# EAGLE schematic Un_SecUSB_2 (EAGLE 7.1.0)
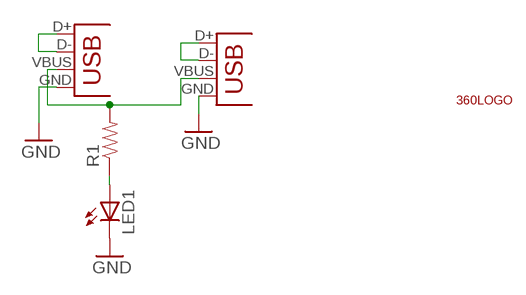
[diagram p0: schematic, sheet 1]

## Parts
LED1  LED0603  [LED-0603]
R1  RESISTOR0603-RES  [0603-RES]
U$1  360LOGO_0.8  [360LOGO_0.8]
X2  USB_4-A-H_2  [USB-A-H_2]
X3  USB_4_3  [USB-A-3]

## Nets
GND: LED1.C X2.GND X3.GND
N$1: R1.2 X2.VBUS X3.VBUS
N$2: X2.D+ X2.D-
N$3: X3.D+ X3.D-
N$4: LED1.A R1.1

## Library data of the parts
LED1 = 2SparkFun:LED: LEDs Standard schematic elements and footprints for 5mm, 3mm, 1206, and 0603 sized LEDs. 5mm - Spark Fun Electronics SKU : COM-00529 (and others)
R1 = 2SparkFun:RESISTOR: Resistor Basic schematic elements and footprints for 0603, 1206, and PTH resistors.
U$1 = 2SparkFun:360LOGO
X2 X3 = 2SparkFun:USB_4: USB Connectors USB-B-PTH is fully proven SKU : PRT-00139 USB-miniB is fully proven SKU : PRT-00587 USB-A-PCB is untested. USB-A-H is throughly reviewed, but untested. Spark Fun Electronics SKU : PRT-00437 USB-B-SMT is throughly reviewed, but untested. Needs silkscreen touching up. USB-A-S has not been used/tested USB-MB-H has not been used/tested